# EAGLE schematic tACS_precision_revised (EAGLE 7.3.0)
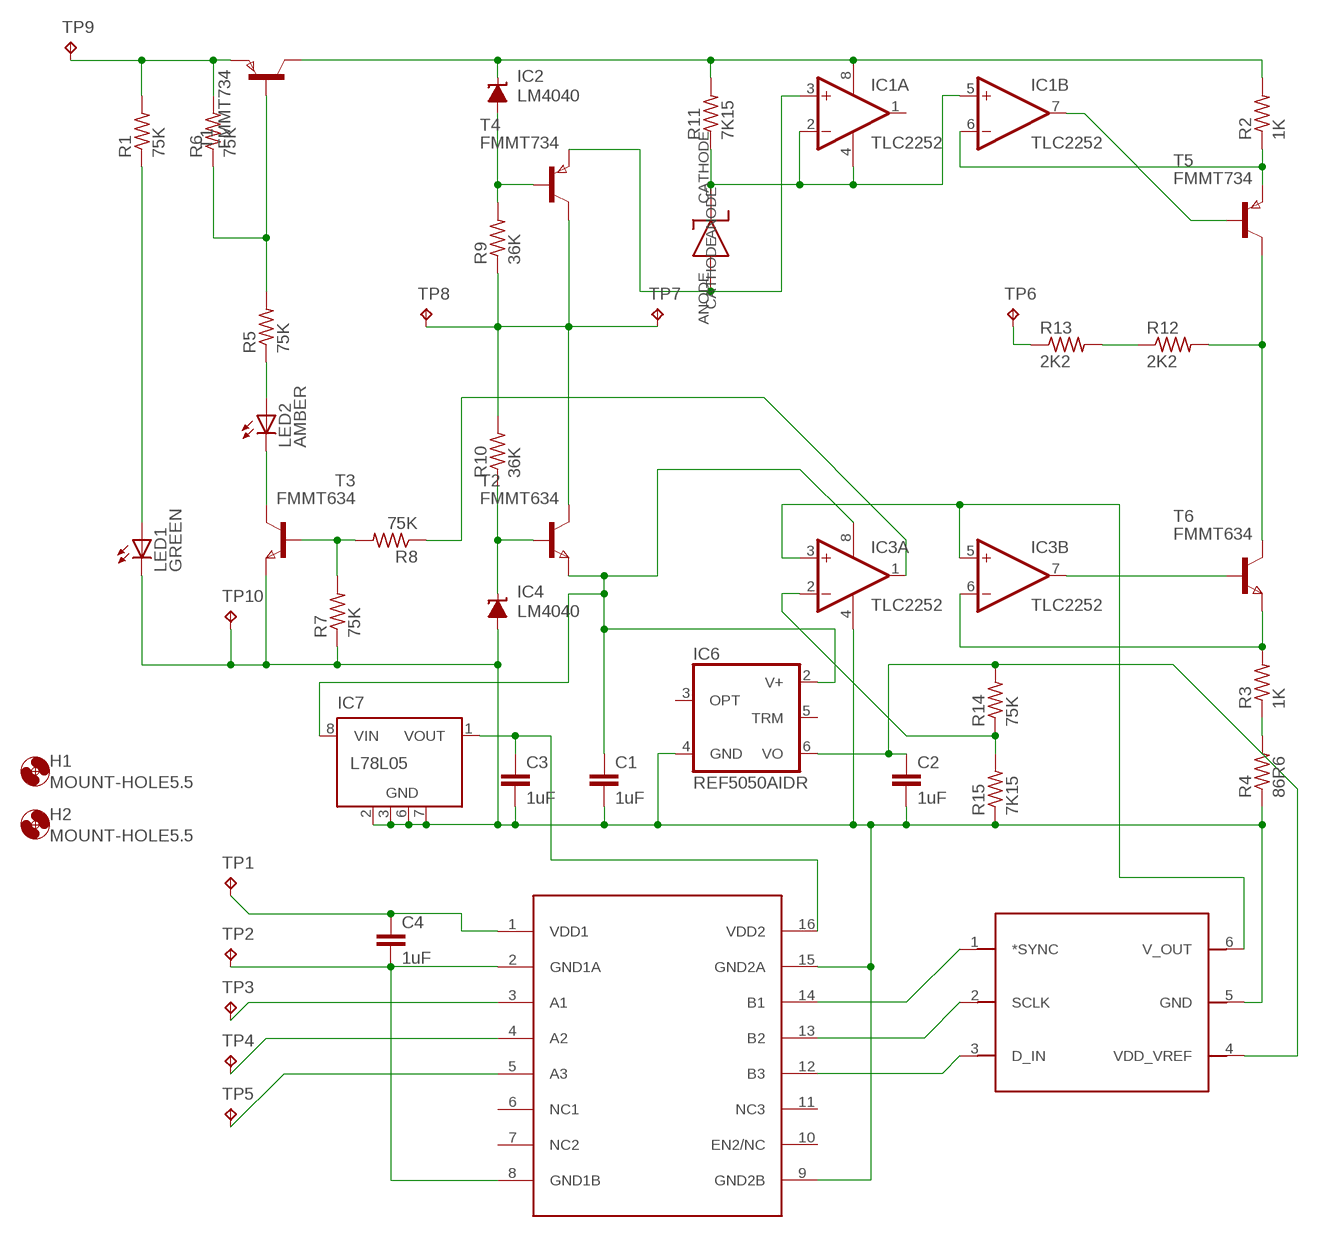
[diagram p0: schematic, sheet 1]

## Parts
C1  1uF  C-EUC1608  [C1608]
C2  1uF  C-EUC1608  [C1608]
C3  1uF  C-EUC1608  [C1608]
C4  1uF  C-EUC1608  [C1608]
H1  MOUNT-HOLE5.5  [5,5]
H2  MOUNT-HOLE5.5  [5,5]
IC1  TLC2252  TLC272D  [SO08]
IC2  LM4040  LM4041A12DBZ  [DBZ_R-PDSO-G3]
IC3  TLC2252  TLC272D  [SO08]
IC4  LM4040  LM4041A12DBZ  [DBZ_R-PDSO-G3]
IC6  REF5050AIDR  REF03D  [SO08]
IC7  L78L05  78L05SMD  [SO08]
LED1  GREEN  LEDSML0603  [SML0603]
LED2  AMBER  LEDSML1206  [SML1206]
R1  75K  R-US_R0603  [R0603]
R2  1K  R-US_R0603  [R0603]
R3  1K  R-US_R0603  [R0603]
R4  86R6  R-US_R0603  [R0603]
R5  75K  R-US_R0603  [R0603]
R6  75K  R-US_R0603  [R0603]
R7  75K  R-US_R0603  [R0603]
R8  75K  R-US_R0603  [R0603]
R9  36K  R-US_R0603  [R0603]
R10  36K  R-US_R0603  [R0603]
R11  7K15  R-US_R0603  [R0603]
R12  2K2  R-US_R2512  [R2512]
R13  2K2  R-US_R2512  [R2512]
R14  75K  R-US_R0603  [R0603]
R15  7K15  R-US_R0603  [R0603]
T1  FMMT734  FMMT720  [SOT-23]
T2  FMMT634  FMMT624  [SOT-23]
T3  FMMT634  FMMT624  [SOT-23]
T4  FMMT734  FMMT720  [SOT-23]
T5  FMMT734  FMMT720  [SOT-23]
T6  FMMT634  FMMT624  [SOT-23]
TP1  TPPAD1-13Y  [P1-13Y]
TP2  TPPAD1-13Y  [P1-13Y]
TP3  TPPAD1-13Y  [P1-13Y]
TP4  TPPAD1-13Y  [P1-13Y]
TP5  TPPAD1-13Y  [P1-13Y]
TP6  TPPAD1-13Y  [P1-13Y]
TP7  TPPAD1-13Y  [P1-13Y]
TP8  TPPAD1-13Y  [P1-13Y]
TP9  TPPAD1-13Y  [P1-13Y]
TP10  TPPAD1-13Y  [P1-13Y]
U$1  DAC7311  [SC70-6]
U$2  SI8630BD  SI8630BD-B-IS  [SOIC16R]
U$3  ADR5041  ADR5041BKSZ  [SC70-3]

## Nets
N$1: LED1.A R1.1
N$2: LED2.C T3.1(C)
N$3: C1.2 C2.2 C3.2 IC3.4(P:V-) IC4.2(A) IC6.4(GND) IC7.2(GND) IC7.3(GND) IC7.6(GND) IC7.7(GND) LED1.C R4.1 R7.1 R15.1 T3.2(E) TP10.TP U$1.5(GND) U$2.9(GND2B) U$2.15(GND2A)
N$4: R1.2 R6.2 T1.2(E) TP9.TP
N$5: R5.2 R6.1 T1.3(B)
N$6: LED2.A R5.1
N$7: R7.2 R8.2 T3.3(B)
N$8: IC1.8(P:V+) IC2.1(C) R2.2 R11.2 T1.1(C)
N$9: IC4.1(C) R10.1 T2.3(B)
N$10: IC2.2(A) R9.2 T4.3(B)
N$11: R9.1 R10.2 T2.1(C) T4.1(C) TP7.TP TP8.TP
N$12: IC3.1(A:OUT) R8.1
N$13: IC1.6(B:-IN) R2.1 T5.2(E)
N$14: IC1.7(B:OUT) T5.3(B)
N$15: IC1.3(A:+IN) T4.2(E) U$3.ANODE
N$16: IC1.2(A:-IN) IC1.4(P:V-) IC1.5(B:+IN) R11.1 U$3.CATHODE
N$17: C1.1 IC3.8(P:V+) IC6.2(V+) IC7.8(VIN) T2.2(E)
N$18: IC3.6(B:-IN) R3.2 T6.2(E)
N$19: R3.1 R4.2
N$20: IC3.7(B:OUT) T6.3(B)
N$21: IC3.3(A:+IN) IC3.5(B:+IN) U$1.6(V_OUT)
N$22: R12.1 R13.2
N$23: R12.2 T5.1(C) T6.1(C)
N$24: R13.1 TP6.TP
N$25: IC3.2(A:-IN) R14.1 R15.2
N$26: C2.1 IC6.6(VO) R14.2 U$1.4(VDD_VREF)
N$27: C4.1 TP1.TP U$2.1(VDD1)
N$29: C4.2 TP2.TP U$2.2(GND1A) U$2.8(GND1B)
N$31: TP3.TP U$2.3(A1)
N$32: TP4.TP U$2.4(A2)
N$33: U$1.1(*SYNC) U$2.14(B1)
N$34: U$1.2(SCLK) U$2.13(B2)
N$35: U$1.3(D_IN) U$2.12(B3)
N$36: C3.1 IC7.1(VOUT) U$2.16(VDD2)
N$37: TP5.TP U$2.5(A3)
Unconnected: IC1.1(A:OUT) IC6.3(OPT) IC6.5(TRM) IC7.4(NC) IC7.5(NC) U$2.6(NC1) U$2.7(NC2) U$2.10(EN2/NC) U$2.11(NC3)

## Library data of the parts
C1-C4 = rcl:C-EU: CAPACITOR, European symbol
H1 H2 = holes:MOUNT-HOLE: MOUNTING HOLE with drill center marker
IC1 IC3 = linear:TLC272: OP AMP
IC2 IC4 = texas:LM4041: PRECISION MICROPOWER SHUNT VOLTAGE REFERENCE Source: http://focus.ti.com/lit/ds/slcs146e/slcs146e.pdf; MPN: LM4041A12IDBZR; OC_FARNELL: 1407949; OC_NEWARK: 58K5875
IC6 = linear:REF03: VOLTAGE REFERENCE
IC7 = linear:78L*SMD: Positive VOLTAGE REGULATOR
LED1 LED2 = led:LED: LED OSRAM: - CHIPLED LG R971, LG N971, LY N971, LG Q971, LY Q971, LO R971, LY R971 LH N974, LH R974 LS Q976, LO Q976, LY Q976 LO Q996 - Hyper CHIPLED LW Q18S LB Q993, LB Q99A, LB R99A - SideLED LS A670, LO A670, LY A670, LG A670, LP A670 LB A673, LV A673, LT A673, LW A673 LH A674 LY A675 LS A676, LA A676, LO A676, LY A676, LW A676 LS A679, LY A679, LG A679 - Hyper Micro SIDELED® LS Y876, LA Y876, LO Y876, LY Y876 LT Y87S - SmartLED LW L88C, LW L88S LB L89C, LB L89S, LG L890 LS L89K, LO L89K, LY L89K LS L896, LA L896, LO L896, LY L896 - TOPLED LS T670, LO T670, LY T670, LG T670, LP T670 LSG T670, LSP T670, LSY T670, LOP T670, LYG T670 LG T671, LOG T671, LSG T671 LB T673, LV T673, LT T673, LW T673 LH T674 LS T676, LA T676, LO T676, LY T676, LB T676, LH T676, LSB T676, LW T676 LB T67C, LV T67C, LT T67C, LS T67K, LO T67K, LY T67K, LW E67C LS E67B, LA E67B, LO E67B, LY E67B, LB E67C, LV E67C, LT E67C LW T67C LS T679, LY T679, LG T679 LS T770, LO T770, LY T770, LG T770, LP T770 LB T773, LV T773, LT T773, LW T773 LH T774 LS E675, LA E675, LY E675, LS T675 LS T776, LA T776, LO T776, LY T776, LB T776 LHGB T686 LT T68C, LB T68C - Hyper Mini TOPLED® LB M676 - Mini TOPLED Santana® LG M470 LS M47K, LO M47K, LY M47K Source: http://www.osram.convergy.de LUXEON: - LUMILED® LXK2-PW12-R00, LXK2-PW12-S00, LXK2-PW14-U00, LXK2-PW14-V00 LXK2-PM12-R00, LXK2-PM12-S00, LXK2-PM14-U00 LXK2-PE12-Q00, LXK2-PE12-R00, LXK2-PE12-S00, LXK2-PE14-T00, LXK2-PE14-U00 LXK2-PB12-K00, LXK2-PB12-L00, LXK2-PB12-M00, LXK2-PB14-N00, LXK2-PB14-P00, LXK2-PB14-Q00 LXK2-PR12-L00, LXK2-PR12-M00, LXK2-PR14-Q00, LXK2-PR14-R00 LXK2-PD12-Q00, LXK2-PD12-R00, LXK2-PD12-S00 LXK2-PH12-R00, LXK2-PH12-S00 LXK2-PL12-P00, LXK2-PL12-Q00, LXK2-PL12-R00 Source: www.luxeon.com KINGBRIGHT: KA-3528ASYC Source: www.kingbright.com
R1-R15 = rcl:R-US_: RESISTOR, American symbol
T1 T4 T5 = zetex:FMMT7*: PNP SILICON POWER (SWITCHING) TRANSISTORS SuperSOT Source: http://www.zetex.com/3.0/pdf/FMMT717.pdf; MPN: FMMT720; OC_FARNELL: 9526471; OC_NEWARK: 96K9969
T2 T3 T6 = zetex:FMMT6*: NPN SILICON POWER (SWITCHING) TRANSISTORS SuperSOT Source: http://www.zetex.com/3.0/pdf/FMMT617.pdf; MPN: FMMT619; OC_FARNELL: 9526447; OC_NEWARK: 84K9343
TP1-TP10 = testpad:TP: Test pad
U$1 = precision_tACS:DAC7311: 12-bit DAC7311
U$2 = precision_tACS:SI8630BD-B-IS: Digital isolator
U$3 = precision_tACS:ADR5041BKSZ